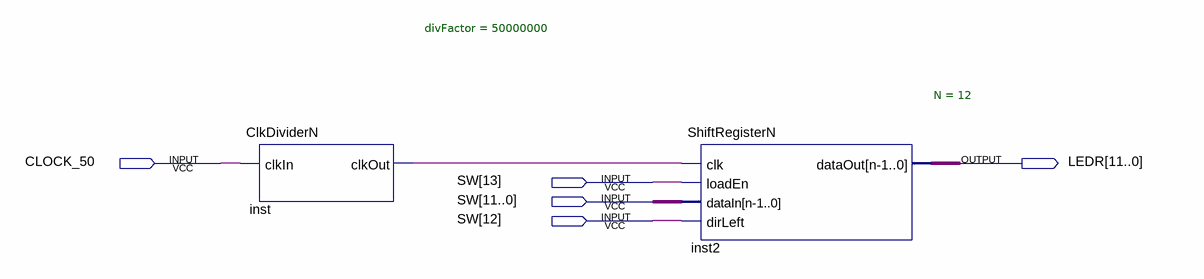
[diagram p0: schematic sheet]
// Quartus schematic ShiftRegister_Demo.bdf as structural Verilog: 2 symbols, 5 pins
module ShiftRegister_Demo (
  input  CLOCK_50,
  input  [13:0] SW,
  output [11:0] LEDR
);

  wire inst_clkout;

  ClkDividerN #(.divFactor(50000000)) inst (.clkIn(CLOCK_50), .clkOut(inst_clkout));
  ShiftRegisterN #(.N(12)) inst2 (
    .clk(inst_clkout), .loadEn(SW[13]), .dataIn(SW[11:0]), .dirLeft(SW[12]), .dataOut(LEDR));
endmodule
